# Altium schematic sheet connect.SchDoc
size A3
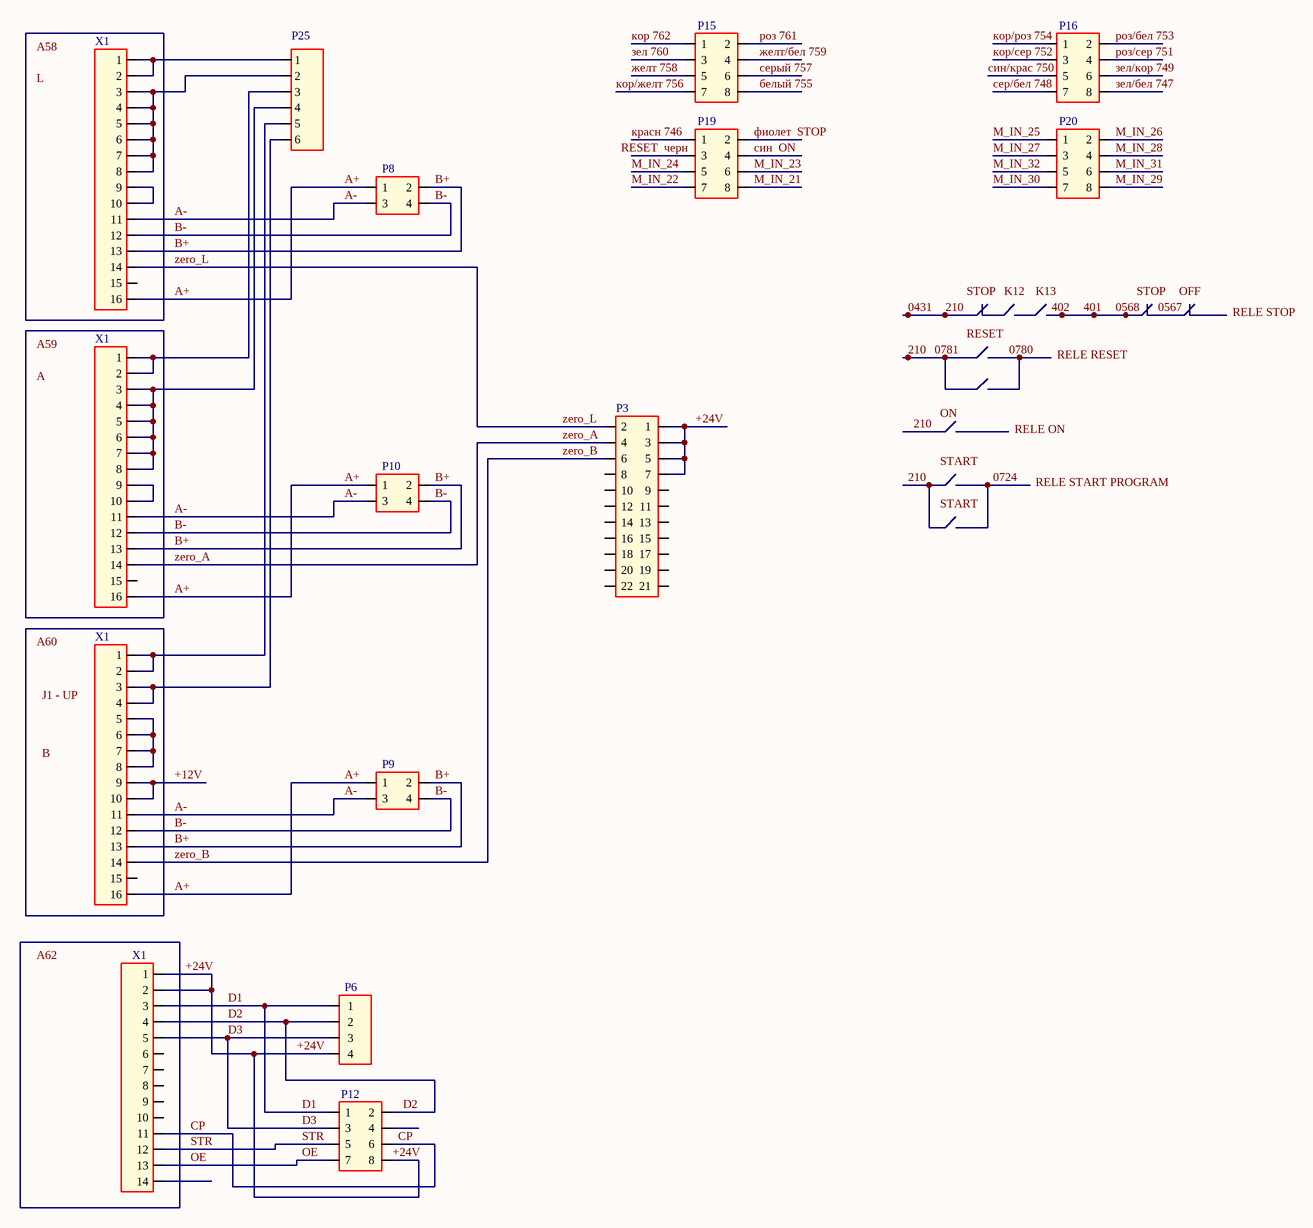
[diagram p0: connect.SchDoc]

## Parts
(Parts that share a designator on the sheet are numbered #1, #2 ... from top to bottom, then left to right.)
P3  Con_11x2  [Con_11x2]  (value not drawn)
P6  Con_4  [Con_4]  (value not drawn)
P8  Con_2x2  [Con_2x2]  (value not drawn)
P9  Con_2x2  [Con_2x2]  (value not drawn)
P10  Con_2x2  [Con_2x2]  (value not drawn)
P12  Con_4x2  [Con_4_2]  (value not drawn)
P15  Con_4x2  [Con_4_2]  (value not drawn)
P16  Con_4x2  [Con_4_2]  (value not drawn)
P19  Con_4x2  [Con_4_2]  (value not drawn)
P20  Con_4x2  [Con_4_2]  (value not drawn)
P25  KLS_6_5mm  [KLS_6_5MM]  (value not drawn)
X1#1  KLS_16_5mm  [KLS_16_5mm]  (value not drawn)
X1#2  KLS_16_5mm  [KLS_16_5mm]  (value not drawn)
X1#3  KLS_16_5mm  [KLS_16_5mm]  (value not drawn)
X1#4  KLS_14_5mm  (value not drawn)

## Nets
+12V: X1#3.9 X1#3.10
+24V: P3.1 P3.3 P3.5 P3.7 P6.4 P12.8 X1#4.1 X1#4.2
A+: P8.1 P9.1 P10.1 X1#1.16 X1#2.16 X1#3.16
A-: P8.3 P9.3 P10.3 X1#1.11 X1#2.11 X1#3.11
B+: P8.2 P9.2 P10.2 X1#1.13 X1#2.13 X1#3.13
B-: P8.4 P9.4 P10.4 X1#1.12 X1#2.12 X1#3.12
CP: P12.6 X1#4.11
D1: P6.1 P12.1 X1#4.3
D2: P6.2 P12.2 X1#4.4
D3: P6.3 P12.3 X1#4.5
M_IN_21: P19.8
M_IN_22: P19.7
M_IN_23: P19.6
M_IN_24: P19.5
M_IN_25: P20.1
M_IN_26: P20.2
M_IN_27: P20.3
M_IN_28: P20.4
M_IN_29: P20.8
M_IN_30: P20.7
M_IN_31: P20.6
M_IN_32: P20.5
OE: P12.7 X1#4.13
STR: P12.5 X1#4.12
zero_A: P3.4 X1#2.14
zero_B: P3.6 X1#3.14
zero_L: P3.2 X1#1.14
белый 755: P15.8
желт 758: P15.5
желт/бел 759: P15.4
зел 760: P15.3
зел/бел 747: P16.8
зел/кор 749: P16.6
кор 762: P15.1
кор/желт 756: P15.7
кор/роз 754: P16.1
кор/сер 752: P16.3
красн 746: P19.1
роз 761: P15.2
роз/бел 753: P16.2
роз/сер 751: P16.4
сер/бел 748: P16.7
серый 757: P15.6
син  ON: P19.4
син/крас 750: P16.5
фиолет  STOP: P19.2
NetP25_1: P25.1 X1#1.1 X1#1.2
NetP25_2: P25.2 X1#1.3 X1#1.4 X1#1.5 X1#1.6 X1#1.7 X1#1.8
NetP25_3: P25.3 X1#2.1 X1#2.2
NetP25_4: P25.4 X1#2.3 X1#2.4 X1#2.5 X1#2.6 X1#2.7 X1#2.8
NetP25_5: P25.5 X1#3.1 X1#3.2
NetP25_6: P25.6 X1#3.3 X1#3.4
NetX1#1_9: X1#1.9 X1#1.10
NetX1#2_9: X1#2.9 X1#2.10
NetX1#3_5: X1#3.5 X1#3.6 X1#3.7 X1#3.8

Not connected (* = marked no-connect by the designer): P3 8 9 10 11 12 13 14 15 16 17 18 19 20 21 22; P12 4; P19 3; X1#1 15; X1#2 15; X1#3 15; X1#4 6 7 8 9 10 14

## Notes on the sheet
- Labels drawn without touching a wire or pin: A, A58, A59, A60, A62, B, J1 - UP, K12, K13, L, OFF, ON, RELE ON, RELE RESET, RELE START PROGRAM, RELE STOP, RESET, RESET  черн, START, STOP